# EAGLE design ELED04 (EAGLE 7.4.0)
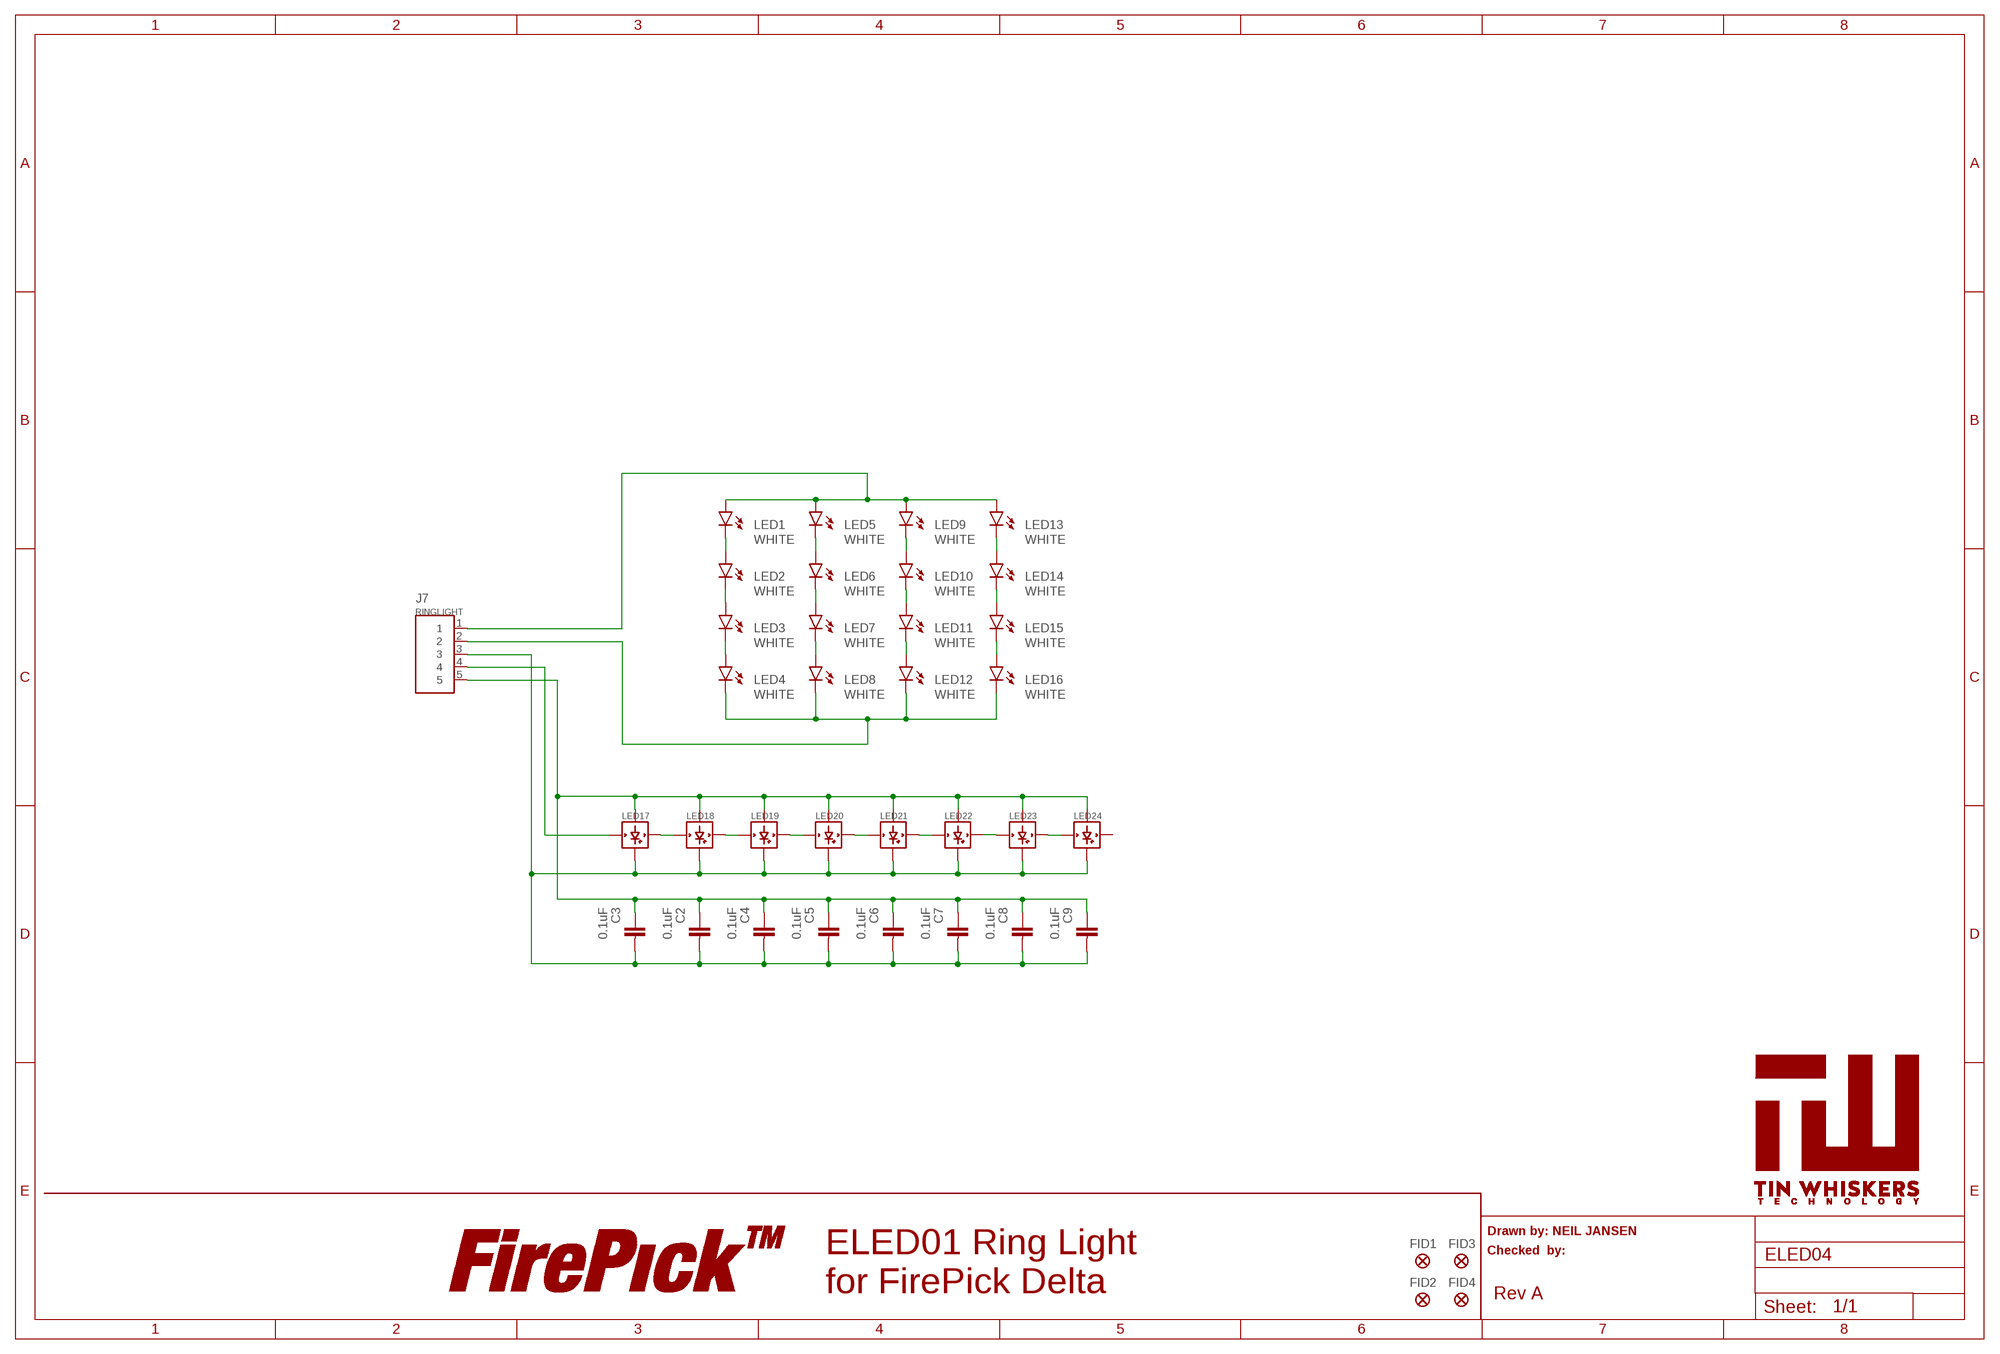
[diagram p0: schematic, sheet 1]

## Parts
C2  0.1uF  CPL-CAP-X5R-0603-0.1UF-35V  [C0603]
C3  0.1uF  CPL-CAP-X5R-0603-0.1UF-35V  [C0603]
C4  0.1uF  CPL-CAP-X5R-0603-0.1UF-35V  [C0603]
C5  0.1uF  CPL-CAP-X5R-0603-0.1UF-35V  [C0603]
C6  0.1uF  CPL-CAP-X5R-0603-0.1UF-35V  [C0603]
C7  0.1uF  CPL-CAP-X5R-0603-0.1UF-35V  [C0603]
C8  0.1uF  CPL-CAP-X5R-0603-0.1UF-35V  [C0603]
C9  0.1uF  CPL-CAP-X5R-0603-0.1UF-35V  [C0603]
FID1  FIDUCIAL  [FIDUCIAL]
FID2  FIDUCIAL  [FIDUCIAL]
FID3  FIDUCIAL  [FIDUCIAL]
FID4  FIDUCIAL  [FIDUCIAL]
J7  RINGLIGHT  CPL-CON-JST-2.0MM-5P-SMT-VRT  [CON-JST-PH-2.0MM-5P-SMT-VRT]
LED1  WHITE  LED1210  [DIODE-1210]
LED2  WHITE  LED1210  [DIODE-1210]
LED3  WHITE  LED1210  [DIODE-1210]
LED4  WHITE  LED1210  [DIODE-1210]
LED5  WHITE  LED1210  [DIODE-1210]
LED6  WHITE  LED1210  [DIODE-1210]
LED7  WHITE  LED1210  [DIODE-1210]
LED8  WHITE  LED1210  [DIODE-1210]
LED9  WHITE  LED1210  [DIODE-1210]
LED10  WHITE  LED1210  [DIODE-1210]
LED11  WHITE  LED1210  [DIODE-1210]
LED12  WHITE  LED1210  [DIODE-1210]
LED13  WHITE  LED1210  [DIODE-1210]
LED14  WHITE  LED1210  [DIODE-1210]
LED15  WHITE  LED1210  [DIODE-1210]
LED16  WHITE  LED1210  [DIODE-1210]
LED17  WS2812B  [WS2812B]
LED18  WS2812B  [WS2812B]
LED19  WS2812B  [WS2812B]
LED20  WS2812B  [WS2812B]
LED21  WS2812B  [WS2812B]
LED22  WS2812B  [WS2812B]
LED23  WS2812B  [WS2812B]
LED24  WS2812B  [WS2812B]
LOGO4  LOGO-FIREPICKMEDIUM  [LOGO-FIREPICK-MEDIUM]
U$3  TIN-WHISKERSSMALL  [TIN-WHISKERS-SMALL]

## Nets
+5V [power]: C2.1 C3.1 C4.1 C5.1 C6.1 C7.1 C8.1 C9.1 J7.5 LED17.1-VDD(VDD) LED18.1-VDD(VDD) LED19.1-VDD(VDD) LED20.1-VDD(VDD) LED21.1-VDD(VDD) LED22.1-VDD(VDD) LED23.1-VDD(VDD) LED24.1-VDD(VDD)
GND [power]: C2.2 C3.2 C4.2 C5.2 C6.2 C7.2 C8.2 C9.2 J7.3 LED17.3-GND(GND) LED18.3-GND(GND) LED19.3-GND(GND) LED20.3-GND(GND) LED21.3-GND(GND) LED22.3-GND(GND) LED23.3-GND(GND) LED24.3-GND(GND)
LED+: J7.1 LED1.A LED5.A LED9.A LED13.A
LED-: J7.2 LED4.K(C) LED8.K(C) LED12.K(C) LED16.K(C)
N$1: LED1.K(C) LED2.A
N$2: LED17.2-DOUT(DOUT) LED18.4-DIN(DIN)
N$3: LED3.K(C) LED4.A
N$4: LED7.K(C) LED8.A
N$5: LED18.2-DOUT(DOUT) LED19.4-DIN(DIN)
N$6: LED2.K(C) LED3.A
N$7: LED6.K(C) LED7.A
N$8: LED10.K(C) LED11.A
N$9: LED14.K(C) LED15.A
N$10: LED19.2-DOUT(DOUT) LED20.4-DIN(DIN)
N$11: LED20.2-DOUT(DOUT) LED21.4-DIN(DIN)
N$12: LED9.K(C) LED10.A
N$13: LED5.K(C) LED6.A
N$14: LED11.K(C) LED12.A
N$15: LED21.2-DOUT(DOUT) LED22.4-DIN(DIN)
N$16: LED22.2-DOUT(DOUT) LED23.4-DIN(DIN)
N$17: LED13.K(C) LED14.A
N$18: LED23.2-DOUT(DOUT) LED24.4-DIN(DIN)
N$19: LED15.K(C) LED16.A
N$20: J7.4 LED17.4-DIN(DIN)
Unconnected: LED24.2-DOUT(DOUT)

## Notes on the sheet
- Drawn by: NEIL JANSEN
- Checked  by:
- ELED01 Ring Light
  for FirePick Delta
- Rev A

## Library data of the parts
C2-C9 = TinWhiskers:CPL-CAP-X5R-0603-0.1UF-35V: Capacitor: 0.1uF, 35V, 10%, X5R; Package: 0603; Datasheet: http://www.yuden.co.jp/productdata/catalog/en/mlcc01_hq_e.pdf; PARTNO: GMK107BJ104KAHT
FID1-FID4 = TinWhiskers:FIDUCIAL; PARTNO: *
J7 = TinWhiskers:CPL-CON-JST-2.0MM-5P-SMT-VRT: Connector: 2.0MM Pitch, 2-Pin; Package: SMT, Vertical; Datasheet: http://www.jst-mfg.com/product/pdf/eng/ePH.pdf; PARTNO: B5B-PH-SM4-TB(LF)(SN)
LED1-LED16 = GinWhiskers - temp stuff:LED; PARTNO: QBLP650-IW
LED17-LED24 = GinWhiskers - temp stuff:WS2812B; PARTNO: 1655
LOGO4 = FirePick:LOGO-FIREPICK; BOM: EXCLUDE; DNP: T
U$3 = !tin-whiskers-logo:TIN-WHISKERS; PARTNO: *

## Net classes
2 power-12V: width 0.3 mm, drill 0.3 mm, clearance 0.3 mm

## Board
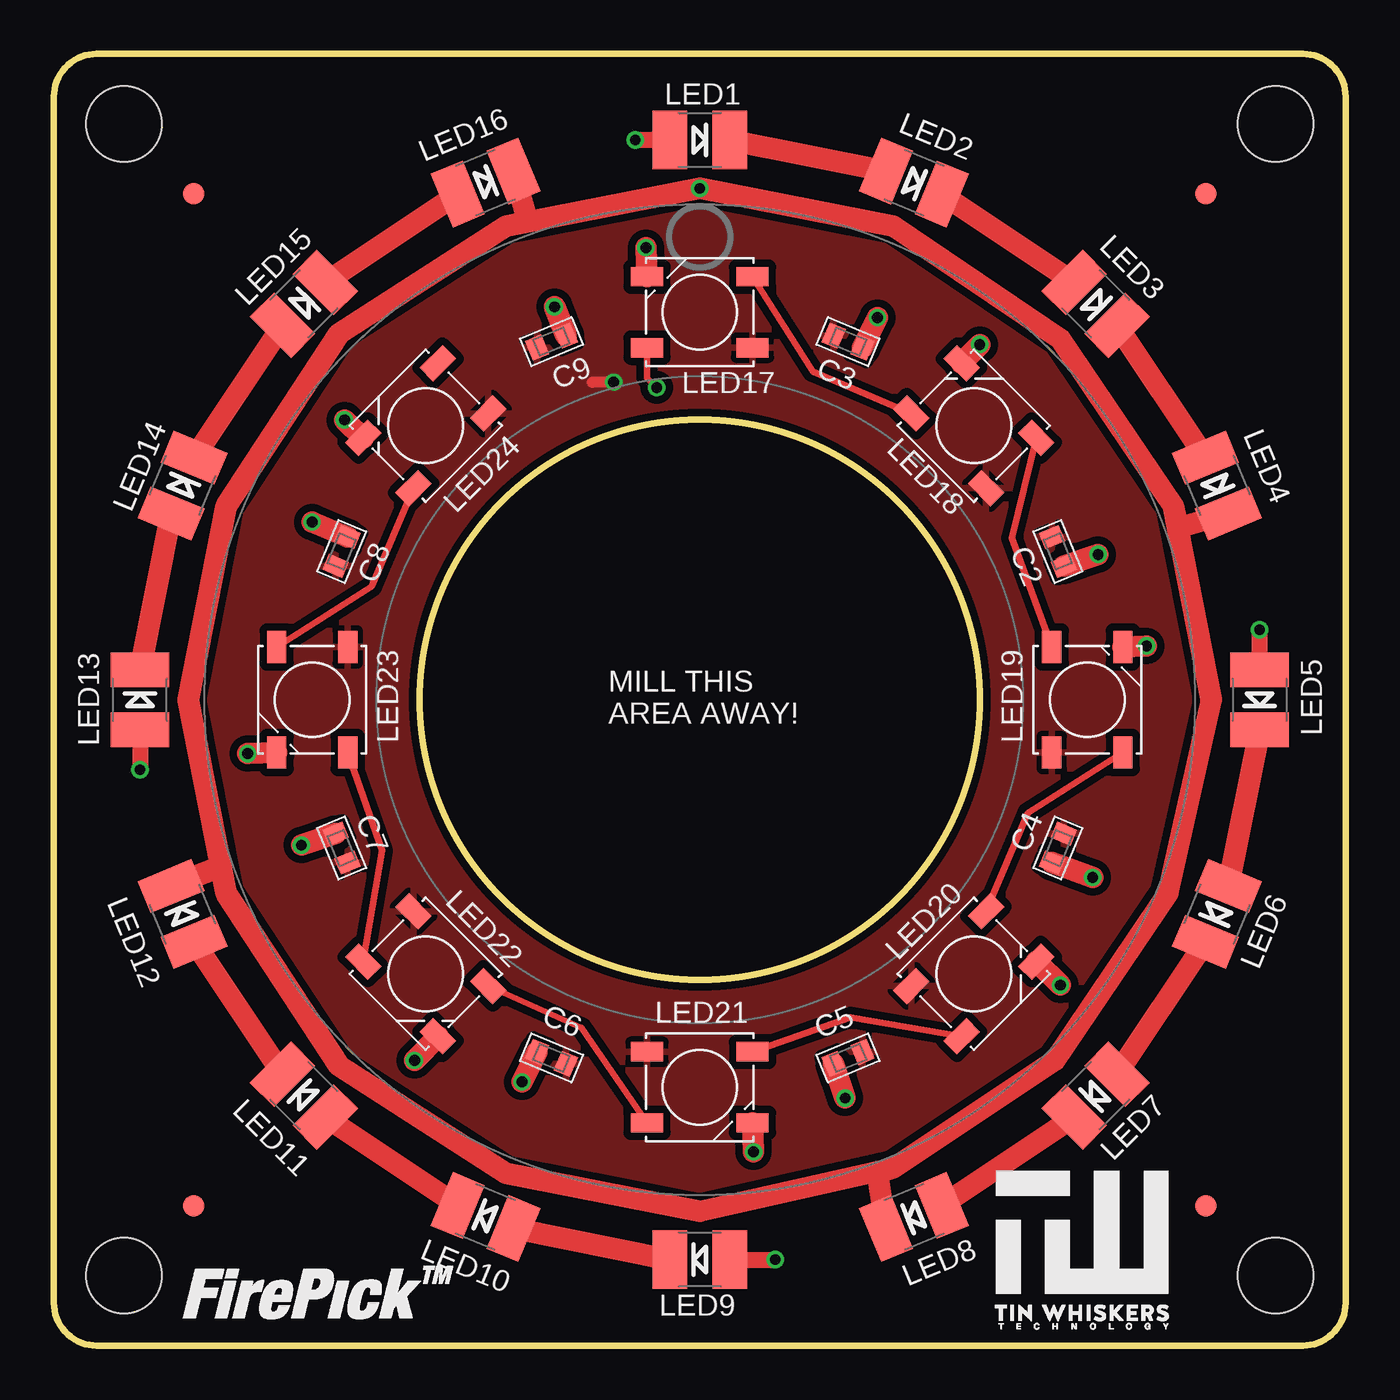
[diagram p1: board, top side]
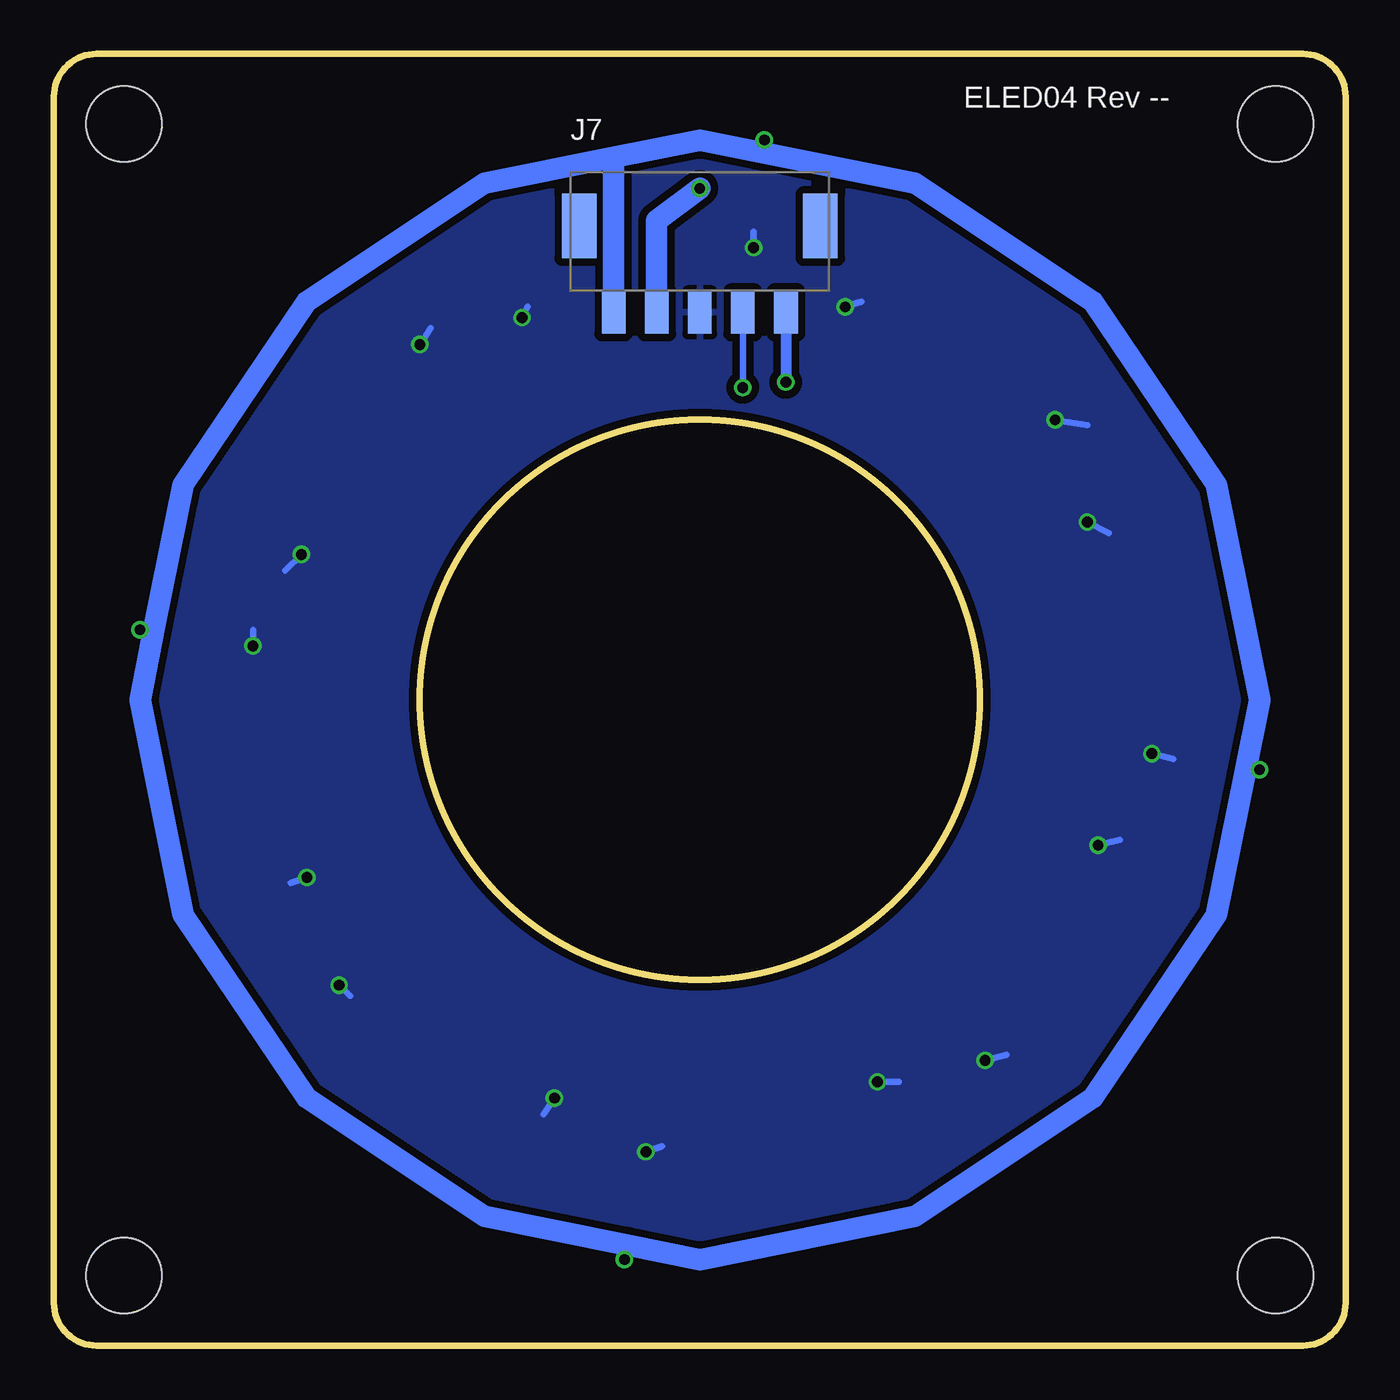
[diagram p2: board, bottom side, seen from below]

Size 60 x 60 mm. Coordinates in mm from the lower left corner, seen from the top.
Outline: 2,0 58,0 arc90 60,2 60,58 arc90 58,60 2,60 arc90 0,58 0,2 arc90 2,0
Outline: circle at 30,30 radius 13
Copper layers (1*16): Top 0.035mm / dielectric 1.5mm / Bottom 0.035mm
Design rules "SeeedStudio_2layer_DRU_no_angle_20140221": minimum track width 6mil, minimum drill 12mil, track to track 6mil, track to pad 6mil, pad to pad 6mil, via to via 6mil, smd to smd 0mil, copper to edge 10mil, drill to drill 10mil, minimum pad ring 10mil, minimum via ring 6mil, stop-mask expansion 2mil, vias tented up to drill 100mil, thermal gap 10mil
Holes 3.5 mm at 3.25,3.25 3.25,56.75 56.75,56.75 56.75,3.25

### Footprints (pad centres in the part's own frame; a part is rotated, then mirrored left to right if it is on the bottom)
C0603 = smd 0.8 x 1: 1 -0.725,0; 2 0.725,0
FIDUCIAL = smd 1 x 1: 1 0,0
CON-JST-PH-2.0MM-5P-SMT-VRT = smd 1.1 x 2: 1 -4,0; 2 -2,0; 3 0,0; 4 2,0; 5 4,0 | smd 1.6 x 3: NC1 -5.6,4; NC2 5.6,4
DIODE-1210 = smd 1.6 x 2.7: A -1.4,0; K 1.4,0
WS2812B = smd 1.5 x 0.9: 1-VDD 2.45,-1.65; 2-DOUT 2.45,1.65; 3-GND -2.45,1.65; 4-DIN -2.45,-1.65

### Placement (x,y rotation side)
C2  46.63,36.89 292.5 top
C3  36.89,46.63 337.5 top
C4  46.63,23.11 247.5 top
C5  36.89,13.37 202.5 top
C6  23.11,13.37 157.5 top
C7  13.37,23.11 112.5 top
C8  13.37,36.89 67.5 top
C9  23.11,46.63 22.5 top
FID1  6.5,53.5 0 top
FID2  53.5,6.5 0 top
FID3  6.5,6.5 0 top
FID4  53.5,53.5 0 top
J7  30,48 0 bottom
LED1  30,56 0 top
LED2  39.95,54.02 337.5 top
LED3  48.39,48.39 315 top
LED4  54.02,39.95 292.5 top
LED5  56,30 270 top
LED6  54.02,20.05 247.5 top
LED7  48.39,11.61 225 top
LED8  39.95,5.98 202.5 top
LED9  30,4 180 top
LED10  20.05,5.98 157.5 top
LED11  11.61,11.61 135 top
LED12  5.98,20.05 112.5 top
LED13  4,30 90 top
LED14  5.98,39.95 67.5 top
LED15  11.61,48.39 45 top
LED16  20.05,54.02 22.5 top
LED17  30,48 0 top
LED18  42.73,42.73 315 top
LED19  48,30 270 top
LED20  42.73,17.27 225 top
LED21  30,12 180 top
LED22  17.27,17.27 135 top
LED23  12,30 90 top
LED24  17.27,42.73 45 top
LOGO4  6,1.25 0 top
U$3  43.25,0.5 0 top

### Tracks (layer width: path | path; a pad name or v marks a point on that pad's centre or on a via)
+5V  (via drill 0.5)
  Top 0.5: v26,44.75 25,44.75
  Bottom 0.5: J7.5 v26,44.75
  pour Top (isolate 0.35, rank 2): 0,60 60,60 60,0 0,0
GND  (via drill 0.5)
  Top 1: LED17.3-GND v27.5,51 | LED18.3-GND v43,46.5 | LED19.3-GND v50.75,32.5 | LED20.3-GND v46.75,16.75 | LED21.3-GND v32.5,9 | LED22.3-GND v16.75,13.25 | LED23.3-GND v9,27.5 | LED24.3-GND v13.5,43 | C3.2 v38.25,47.75 | C2.2 v48.5,36.75 | C4.2 v48.25,21.75 | C5.2 v36.75,11.5 | C6.2 v21.75,12.25 | C7.2 v11.5,23.25 | C8.2 v12,38.25 | C9.2 v23.25,48.25
  Bottom 0.305: v27.5,51 27.5,51.75 | v43,46.5 42.5,47.25 | v50.75,32.5 50.75,33.25 | v46.75,16.75 46.25,16.25 | v32.5,9 31.75,9.25 | v16.75,13.25 15.75,13.5 | v9,27.5 8,27.25 | v13.5,43 12,42.75 | v38.25,47.75 38,48.25 | v48.5,36.75 49.25,36 | v48.25,21.75 49,21.5 | v36.75,11.5 37.25,10.75 | v21.75,12.25 20.75,12.25 | v11.5,23.25 10.5,23.5 | v12,38.25 11,37.75 | v23.25,48.25 22.5,48.5
  pour Bottom (isolate 0.35, rank 2): 0,60 60,60 60,0 0,0
LED+  (via drill 0.5)
  Top 0.75: LED13.A v4,26.75 | LED9.A v33.5,4 | LED5.A v56,33.25 | LED1.A v27,56
  Bottom 0.5: 34,55.1 34.09,55.18
  Bottom 0.75: v4,26.75 4.48,26.75 4.69,26.54 | v33.5,4 33.5,4.6 33.41,4.68 | v56,33.25 55.52,33.25 55.31,33.46 | v27,56 27,55.77 27.31,55.46
  Bottom 1: J7.1 34,55.1 | 40,6 48.25,11.5 54,20 56,30 55.31,33.46 54,40 48.25,48.5 40,54 34.09,55.18 30,56 27.31,55.46 20,54 11.75,48.5 6,40 4,30 4.69,26.54 6,20 11.75,11.5 20,6 30,4 33.41,4.68 40,6
LED-  (via drill 0.5)
  Top 1: 52,39 53.75,30 51.75,21 46.5,13.25 39,8.25 | 52,39 46.75,46.75 39,52 v30,53.75 21,52 | 21,52 13.25,47 8,39 6.25,30 8,21 | 8,21 13.25,13 21,8 30,6.25 39,8.25 | LED8.K 38.25,8 39,8.25 | LED12.K 7.75,22.25 8,21 | LED16.K 22,52.25 21,52 | LED4.K 52.25,38 52,39
  Bottom 1: J7.2 32,52.25 v30,53.75
N$1
  Top 1: LED1.K LED2.A
N$2
  Top 0.305: LED17.2-DOUT 35.25,45.25 LED18.4-DIN
N$3
  Top 1: LED3.K LED4.A
N$4
  Top 1: LED8.A LED7.K
N$5
  Top 0.305: LED18.2-DOUT 44.5,37.5 LED19.4-DIN
N$6
  Top 1: LED2.K LED3.A
N$7
  Top 1: LED7.A LED6.K
N$8
  Top 1: LED11.A LED10.K
N$9
  Top 1: LED15.A LED14.K
N$10
  Top 0.305: LED19.2-DOUT 45.25,24.75 LED20.4-DIN
N$11
  Top 0.305: LED20.2-DOUT 37,15.25 LED21.4-DIN
N$12
  Top 1: LED10.A LED9.K
N$13
  Top 1: LED6.A LED5.K
N$14
  Top 1: LED12.A LED11.K
N$15
  Top 0.305: LED21.2-DOUT 24.5,14.75 LED22.4-DIN
N$16
  Top 0.305: LED22.2-DOUT 15.25,23 LED23.4-DIN
N$17
  Top 1: LED13.K LED14.A
N$18
  Top 0.305: LED23.2-DOUT 14.75,35.25 LED24.4-DIN
N$19
  Top 1: LED15.K LED16.A
N$20  (via drill 0.5)
  Top 0.305: LED17.4-DIN 27.55,44.95 v28,44.5
  Bottom 0.305: J7.4 28,45 v28,44.5

### Text on the board
tPlace: MILL THIS / AREA AWAY!
bPlace: ELED04 Rev --